# Altium project ExoSkeleton Master PCB V1.0.PrjPcb
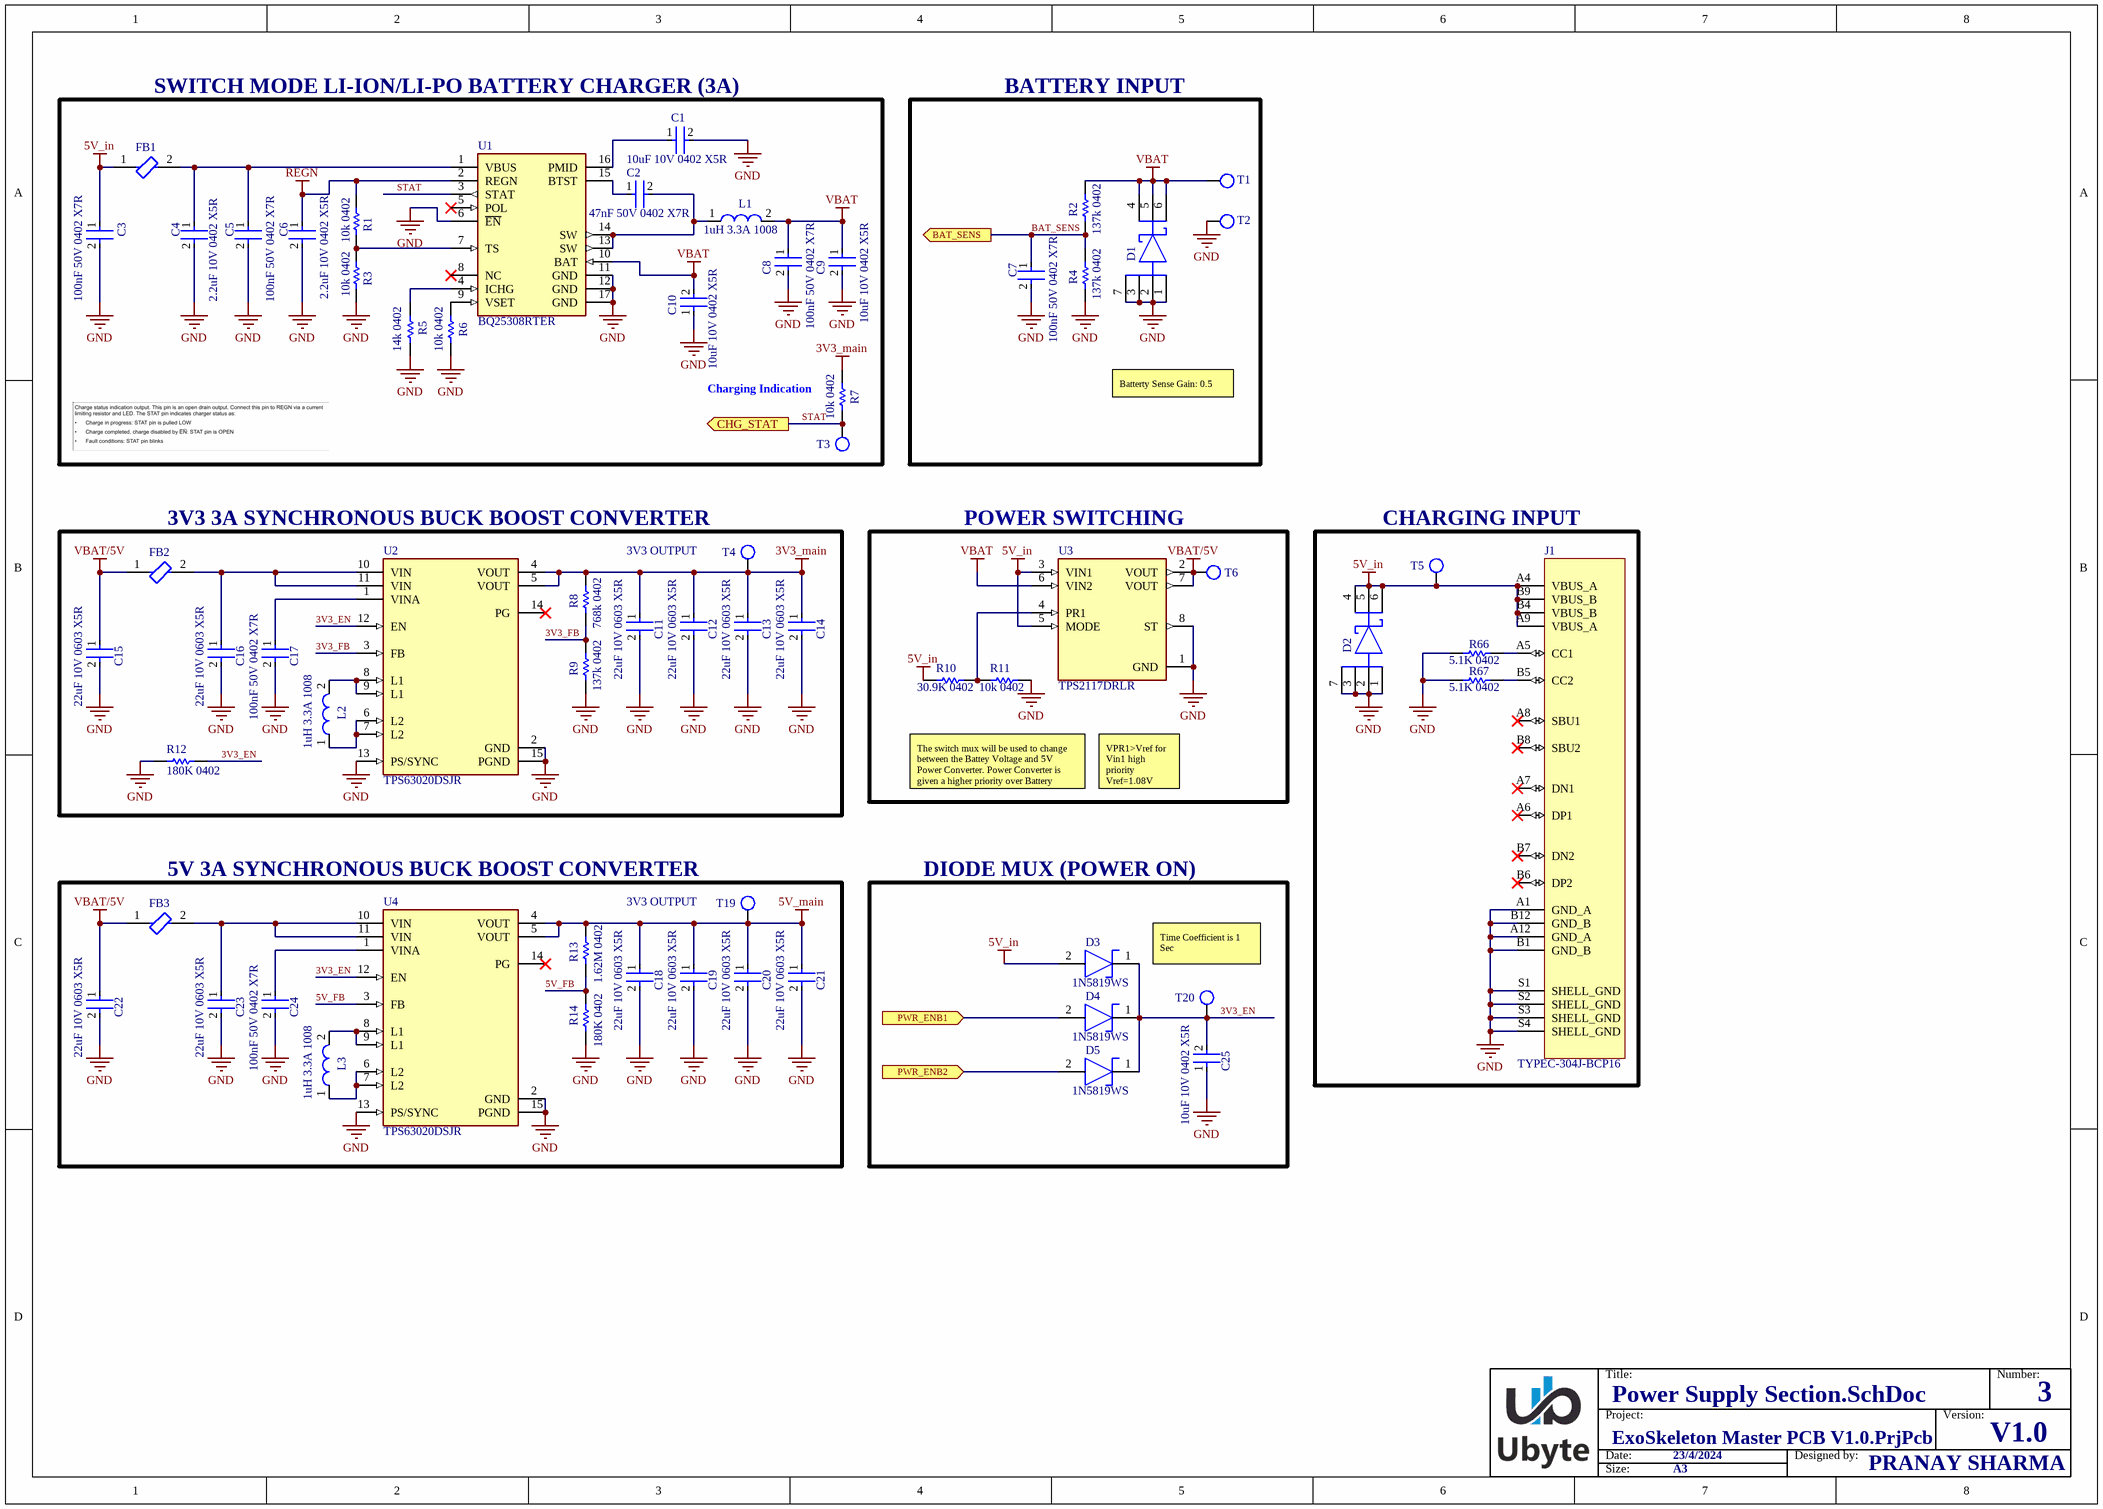
[diagram p0: Power Supply Section.SchDoc]
3 sheets, 130 parts. Net scope: flat (ports and power ports of the same name join across sheets).
Board file: PCB V1.0.PcbDoc
Sheets:
  Power Supply Section.SchDoc
  RS485 Com and Connectors.SchDoc
  IMU Section.SchDoc

## Sheet Power Supply Section.SchDoc
size A3; SheetNumber: 2; SheetTotal: 7

### Parts
C1  10uF 10V 0402 X5R  [0402 IPC CLASS C CAPACITOR]
C2  47nF 50V 0402 X7R  [0402 IPC CLASS C CAPACITOR]
C3  100nF 50V 0402 X7R  [0402 IPC CLASS C CAPACITOR]
C4  2.2uF 10V 0402 X5R  [0402 IPC CLASS C CAPACITOR]
C5  100nF 50V 0402 X7R  [0402 IPC CLASS C CAPACITOR]
C6  2.2uF 10V 0402 X5R  [0402 IPC CLASS C CAPACITOR]
C7  100nF 50V 0402 X7R  [0402 IPC CLASS C CAPACITOR]
C8  100nF 50V 0402 X7R  [0402 IPC CLASS C CAPACITOR]
C9  10uF 10V 0402 X5R  [0402 IPC CLASS C CAPACITOR]
C10  10uF 10V 0402 X5R  [0402 IPC CLASS C CAPACITOR]
C11  22uF 10V 0603 X5R  [0603 IPC CLASS C CAPACITOR]
C12  22uF 10V 0603 X5R  [0603 IPC CLASS C CAPACITOR]
C13  22uF 10V 0603 X5R  [0603 IPC CLASS C CAPACITOR]
C14  22uF 10V 0603 X5R  [0603 IPC CLASS C CAPACITOR]
C15  22uF 10V 0603 X5R  [0603 IPC CLASS C CAPACITOR]
C16  22uF 10V 0603 X5R  [0603 IPC CLASS C CAPACITOR]
C17  100nF 50V 0402 X7R  [0402 IPC CLASS C CAPACITOR]
C18  22uF 10V 0603 X5R  [0603 IPC CLASS C CAPACITOR]
C19  22uF 10V 0603 X5R  [0603 IPC CLASS C CAPACITOR]
C20  22uF 10V 0603 X5R  [0603 IPC CLASS C CAPACITOR]
C21  22uF 10V 0603 X5R  [0603 IPC CLASS C CAPACITOR]
C22  22uF 10V 0603 X5R  [0603 IPC CLASS C CAPACITOR]
C23  22uF 10V 0603 X5R  [0603 IPC CLASS C CAPACITOR]
C24  100nF 50V 0402 X7R  [0402 IPC CLASS C CAPACITOR]
C25  10uF 10V 0402 X5R  [0402 IPC CLASS C CAPACITOR]
D1  (no value)  [DRV0006A IPC-C]
D2  (no value)  [DRV0006A IPC-C]
D3  1N5819WS  [SOD-323 IPC-C]
D4  1N5819WS  [SOD-323 IPC-C]
D5  1N5819WS  [SOD-323 IPC-C]
FB1  BLM21SP111SN1D  [0603 IPC CLASS C FERRITE BEAD]  (value not drawn)
FB2  BLM21SP111SN1D  [0603 IPC CLASS C FERRITE BEAD]  (value not drawn)
FB3  BLM21SP111SN1D  [0603 IPC CLASS C FERRITE BEAD]  (value not drawn)
J1  TYPEC-304J-BCP16  [VALCON_CSP-USC16-TR]
L1  1uH 3.3A 1008  [1008 Inductor IPC-C]
L2  1uH 3.3A 1008  [1008 Inductor IPC-C]
L3  1uH 3.3A 1008  [1008 Inductor IPC-C]
R1  10k 0402  [0402 IPC CLASS C RESISTOR]
R2  137k 0402  [0402 IPC CLASS C RESISTOR]
R3  10k 0402  [0402 IPC CLASS C RESISTOR]
R4  137k 0402  [0402 IPC CLASS C RESISTOR]
R5  14k 0402  [0402 IPC CLASS C RESISTOR]
R6  10k 0402  [0402 IPC CLASS C RESISTOR]
R7  10k 0402  [0402 IPC CLASS C RESISTOR]
R8  768k 0402  [0402 IPC CLASS C RESISTOR]
R9  137k 0402  [0402 IPC CLASS C RESISTOR]
R10  30.9K 0402  [0402 IPC CLASS C RESISTOR]
R11  10k 0402  [0402 IPC CLASS C RESISTOR]
R12  180K 0402  [0402 IPC CLASS C RESISTOR]
R13  1.62M 0402  [0402 IPC CLASS C RESISTOR]
R14  180K 0402  [0402 IPC CLASS C RESISTOR]
R66  5.1K 0402  [0402 IPC CLASS C RESISTOR]
R67  5.1K 0402  [0402 IPC CLASS C RESISTOR]
T1  Test Point TH  [Test Point TH]  (value not drawn)  (no BOM)
T2  Test Point TH  [Test Point TH]  (value not drawn)  (no BOM)
T3  TP  [Testpoint1]  (value not drawn)  (no BOM)
T4  TP  [Testpoint1]  (value not drawn)  (no BOM)
T5  TP  [Testpoint1]  (value not drawn)  (no BOM)
T6  TP  [Testpoint1]  (value not drawn)  (no BOM)
T19  TP  [Testpoint1]  (value not drawn)  (no BOM)
T20  TP  [Testpoint1]  (value not drawn)  (no BOM)
U1  BQ25308RTER  [RTE0016C IPC-C]
U2  TPS63020DSJR  [FP-DSJ0014A-MFG]
U3  TPS2117DRLR  [DRL0008A IPC-C]
U4  TPS63020DSJR  [FP-DSJ0014A-MFG]

### Blocks framed on the sheet
SWITCH MODE LI-ION/LI-PO BATTERY CHARGER (3A): C1-C6 C8-C10 FB1 L1 R1 R3 R5-R7 T3 U1
BATTERY INPUT: C7 D1 R2 R4 T1 T2
3V3 3A SYNCHRONOUS BUCK BOOST CONVERTER: C11-C17 FB2 L2 R8 R9 R12 T4 U2
POWER SWITCHING: R10 R11 T6 U3
CHARGING INPUT: D2 J1 R66 R67 T5
5V 3A SYNCHRONOUS BUCK BOOST CONVERTER: C18-C24 FB3 L3 R13 R14 T19 U4
DIODE MUX (POWER ON): C25 D3-D5 T20

### Ports
BAT_SENS (out), CHG_STAT (out), PWR_ENB1 (in), PWR_ENB2 (in)

### Nets
3V3_main: C11.1 C12.1 C13.1 C14.1 R7.2 R8.1 T4.0 U2.4(VOUT) U2.5(VOUT)
5V_in: C3.1 D2.4 D2.5 D2.6 D3.2(A) FB1.1 J1.A4(VBUS_A) J1.A9(VBUS_A) J1.B4(VBUS_B) J1.B9(VBUS_B) R10.2 T5.0 U3.3(VIN1) U3.5(MODE)
5V_main: C18.1 C19.1 C20.1 C21.1 R13.2 T19.0 U4.4(VOUT) U4.5(VOUT)
GND: C1.2 C3.2 C4.2 C5.2 C6.2 C7.2 C8.2 C9.2 C10.1 C11.2 C12.2 C13.2 C14.2 C15.2 C16.2 C17.2 C18.2 C19.2 C20.2 C21.2 C22.2 C23.2 C24.2 C25.1 D1.1(C) D1.2(A) D1.3 D1.7 D2.1(C) D2.2(A) D2.3 D2.7 J1.A1(GND_A) J1.A12(GND_A) J1.B1(GND_B) J1.B12(GND_B) J1.S1(SHELL_GND) J1.S2(SHELL_GND) J1.S3(SHELL_GND) J1.S4(SHELL_GND) R3.1 R4.1 R5.1 R6.1 R9.1 R11.1 R12.2 R14.1 R66.1 R67.1 T2.0 U1.6(~{EN}) U1.11(GND) U1.12(GND) U1.17(GND) U2.2(GND) U2.13(PS/SYNC) U2.15(PGND) U3.1(GND) U3.8(ST) U4.2(GND) U4.13(PS/SYNC) U4.15(PGND)
REGN: C6.1 R1.2 U1.2(REGN)
VBAT: C8.1 C9.1 C10.2 D1.4 D1.5 D1.6 L1.2 R2.2 T1.0 U1.10(BAT) U3.6(VIN2)
VBAT/5V: C15.1 C22.1 FB2.1 FB3.1 T6.0 U3.2(VOUT) U3.7(VOUT)
3V3_EN: C25.2 D3.1(C) D4.1(C) D5.1(C) R12.1 T20.0 U2.12(EN) U4.12(EN)
3V3_FB: R8.2 R9.2 U2.3(FB)
5V_FB: R13.1 R14.2 U4.3(FB)
BAT_SENS: C7.1 R2.1 R4.2 ; port BAT_SENS
STAT: R7.1 T3.0 U1.3(STAT) ; port CHG_STAT
NetC1_1: C1.1 U1.16(PMID)
NetC2_1: C2.1 U1.15(BTST)
NetC2_2: C2.2 L1.1 U1.13(SW) U1.14(SW)
NetC4_1: C4.1 C5.1 FB1.2 U1.1(VBUS)
NetC16_1: C16.1 FB2.2 U2.10(VIN) U2.11(VIN)
NetC17_1: C17.1 U2.1(VINA)
NetC23_1: C23.1 FB3.2 U4.10(VIN) U4.11(VIN)
NetC24_1: C24.1 U4.1(VINA)
NetD4_2: D4.2(A) ; port PWR_ENB1
NetD5_2: D5.2(A) ; port PWR_ENB2
NetJ1_A5: J1.A5(CC1) R66.2
NetJ1_B5: J1.B5(CC2) R67.2
NetL2_1: L2.1 U2.6(L2) U2.7(L2)
NetL2_2: L2.2 U2.8(L1) U2.9(L1)
NetL3_1: L3.1 U4.6(L2) U4.7(L2)
NetL3_2: L3.2 U4.8(L1) U4.9(L1)
NetR1_1: R1.1 R3.2 U1.7(TS)
NetR5_2: R5.2 U1.4(ICHG)
NetR6_2: R6.2 U1.9(VSET)
NetR10_1: R10.1 R11.2 U3.4(PR1)

Not connected (* = marked no-connect by the designer): J1 A6(DP1)* A7(DN1)* A8(SBU1)* B6(DP2)* B7(DN2)* B8(SBU2)*; U1 5(POL)* 8(NC)*; U2 14(PG)*; U4 14(PG)*

### Notes on the sheet
- (near R7) Charging Indication
- Batterty Sense Gain: 0.5
- 3V3 OUTPUT
- The switch mux will be used to change between the Battey Voltage and 5V Power Converter. Power Converter is given a higher priority over Battery
- VPR1>Vref for Vin1 high priority
  Vref=1.08V
- Time Coefficient is 1 Sec
- Title:
- Number:
- Date:
- Project:
- 23/4/2024
- Designed by:
- Version:
- V1.0
- 3
- Size:
- A3
- PRANAY SHARMA

### Library data of the parts
D1 D2 = TVS0500DRVR
J1 = USB Type C
L1-L3 = DFE252012F-1R0M=P2
R1-R4 R6-R9 R11 = 10k 1% 0402
R5 = 14k 1% 0402
R10 = 30.9K 1%  0402
R12 R14 = 180K 1% 0402
R13 = 1.62M 1% 0402
R66 R67 = 5.1K 1% 0402
T3-T6 T19 T20 = Testpoint1
U2 U4 = CMP-2000-07282-2

## Sheet RS485 Com and Connectors.SchDoc
size A4; SheetNumber: 3; SheetTotal: 7
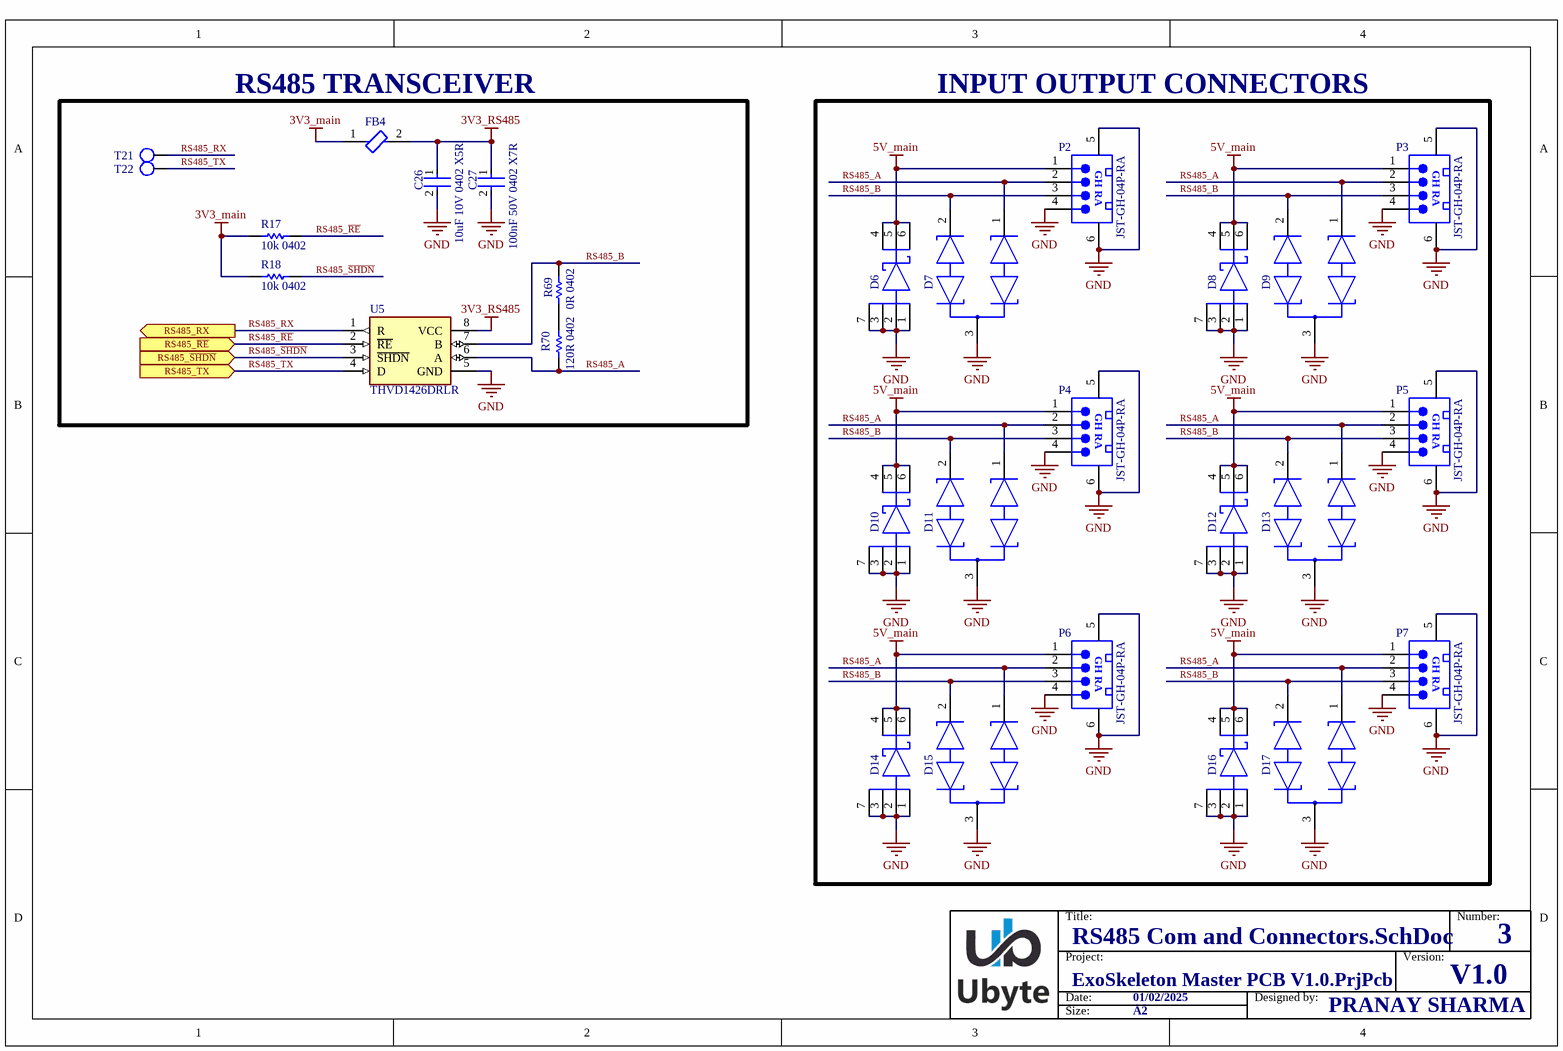
[diagram p1: RS485 Com and Connectors.SchDoc]

### Parts
C26  10uF 10V 0402 X5R  [0402 IPC CLASS C CAPACITOR]
C27  100nF 50V 0402 X7R  [0402 IPC CLASS C CAPACITOR]
D6  (no value)  [DRV0006A IPC-C]
D7  (no value)  [FP-SOT23-IPC_C]
D8  (no value)  [DRV0006A IPC-C]
D9  (no value)  [FP-SOT23-IPC_C]
D10  (no value)  [DRV0006A IPC-C]
D11  (no value)  [FP-SOT23-IPC_C]
D12  (no value)  [DRV0006A IPC-C]
D13  (no value)  [FP-SOT23-IPC_C]
D14  (no value)  [DRV0006A IPC-C]
D15  (no value)  [FP-SOT23-IPC_C]
D16  (no value)  [DRV0006A IPC-C]
D17  (no value)  [FP-SOT23-IPC_C]
FB4  BLM15AX102SN1D  [0402 IPC CLASS C FERRITE BEAD]  (value not drawn)
P2  JST-GH-04P-RA  [JST-GH-04P-RA]
P3  JST-GH-04P-RA  [JST-GH-04P-RA]
P4  JST-GH-04P-RA  [JST-GH-04P-RA]
P5  JST-GH-04P-RA  [JST-GH-04P-RA]
P6  JST-GH-04P-RA  [JST-GH-04P-RA]
P7  JST-GH-04P-RA  [JST-GH-04P-RA]
R17  10k 0402  [0402 IPC CLASS C RESISTOR]
R18  10k 0402  [0402 IPC CLASS C RESISTOR]
R69  0R 0402  [0402 IPC CLASS B RESISTOR]
R70  120R 0402  [0402 IPC CLASS C RESISTOR]
T21  TP  [Testpoint1]  (value not drawn)  (no BOM)
T22  TP  [Testpoint1]  (value not drawn)  (no BOM)
U5  THVD1426DRLR  [DRL0008A IPC-C]

### Blocks framed on the sheet
RS485 TRANSCEIVER: C26 C27 FB4 R17 R18 R69 R70 T21 T22 U5
INPUT OUTPUT CONNECTORS: D6-D17 P2-P7

### Ports
RS485_RX (out), RS485_TX (in), RS485_~{RE} (in), RS485_~{SHDN} (in)

### Nets
3V3_main: FB4.1 R17.2 R18.2
3V3_RS485: C26.1 C27.1 FB4.2 U5.8(VCC)
5V_main: D6.4 D6.5 D6.6 D8.4 D8.5 D8.6 D10.4 D10.5 D10.6 D12.4 D12.5 D12.6 D14.4 D14.5 D14.6 D16.4 D16.5 D16.6 P2.1 P3.1 P4.1 P5.1 P6.1 P7.1
GND: C26.2 C27.2 D6.1(C) D6.2(A) D6.3 D6.7 D7.3(CC) D8.1(C) D8.2(A) D8.3 D8.7 D9.3(CC) D10.1(C) D10.2(A) D10.3 D10.7 D11.3(CC) D12.1(C) D12.2(A) D12.3 D12.7 D13.3(CC) D14.1(C) D14.2(A) D14.3 D14.7 D15.3(CC) D16.1(C) D16.2(A) D16.3 D16.7 D17.3(CC) P2.4 P2.5 P2.6 P3.4 P3.5 P3.6 P4.4 P4.5 P4.6 P5.4 P5.5 P5.6 P6.4 P6.5 P6.6 P7.4 P7.5 P7.6 U5.5(GND)
RS485_A: D7.1(K1) D9.1(K1) D11.1(K1) D13.1(K1) D15.1(K1) D17.1(K1) P2.2 P3.2 P4.2 P5.2 P6.2 P7.2 R70.1 U5.6(A)
RS485_B: D7.2(K2) D9.2(K2) D11.2(K2) D13.2(K2) D15.2(K2) D17.2(K2) P2.3 P3.3 P4.3 P5.3 P6.3 P7.3 R69.2 U5.7(B)
RS485_~{RE}: R17.1 U5.2(~{RE}) ; port RS485_~{RE}
RS485_RX: T21.0 U5.1(R) ; port RS485_RX
RS485_~{SHDN}: R18.1 U5.3(~{SHDN}) ; port RS485_~{SHDN}
RS485_TX: T22.0 U5.4(D) ; port RS485_TX
NetR69_1: R69.1 R70.2

### Notes on the sheet
- Title:
- Number:
- Date:
- Project:
- 01/02/2025
- Designed by:
- Version:
- V1.0
- Size:
- A2
- PRANAY SHARMA
- (in symbol JST-GH-04P-RA) GH RA

### Library data of the parts
D6 D8 D10 D12 D14 D16 = TVS0500DRVR
D7 D9 D11 D13 D15 D17 = SM712
R17 R18 = 10k 1% 0402
R69 = 0R 1% 0402
R70 = 120R 1% 0402
T21 T22 = Testpoint1

## Sheet IMU Section.SchDoc
size A4; SheetNumber: 4; SheetTotal: 7
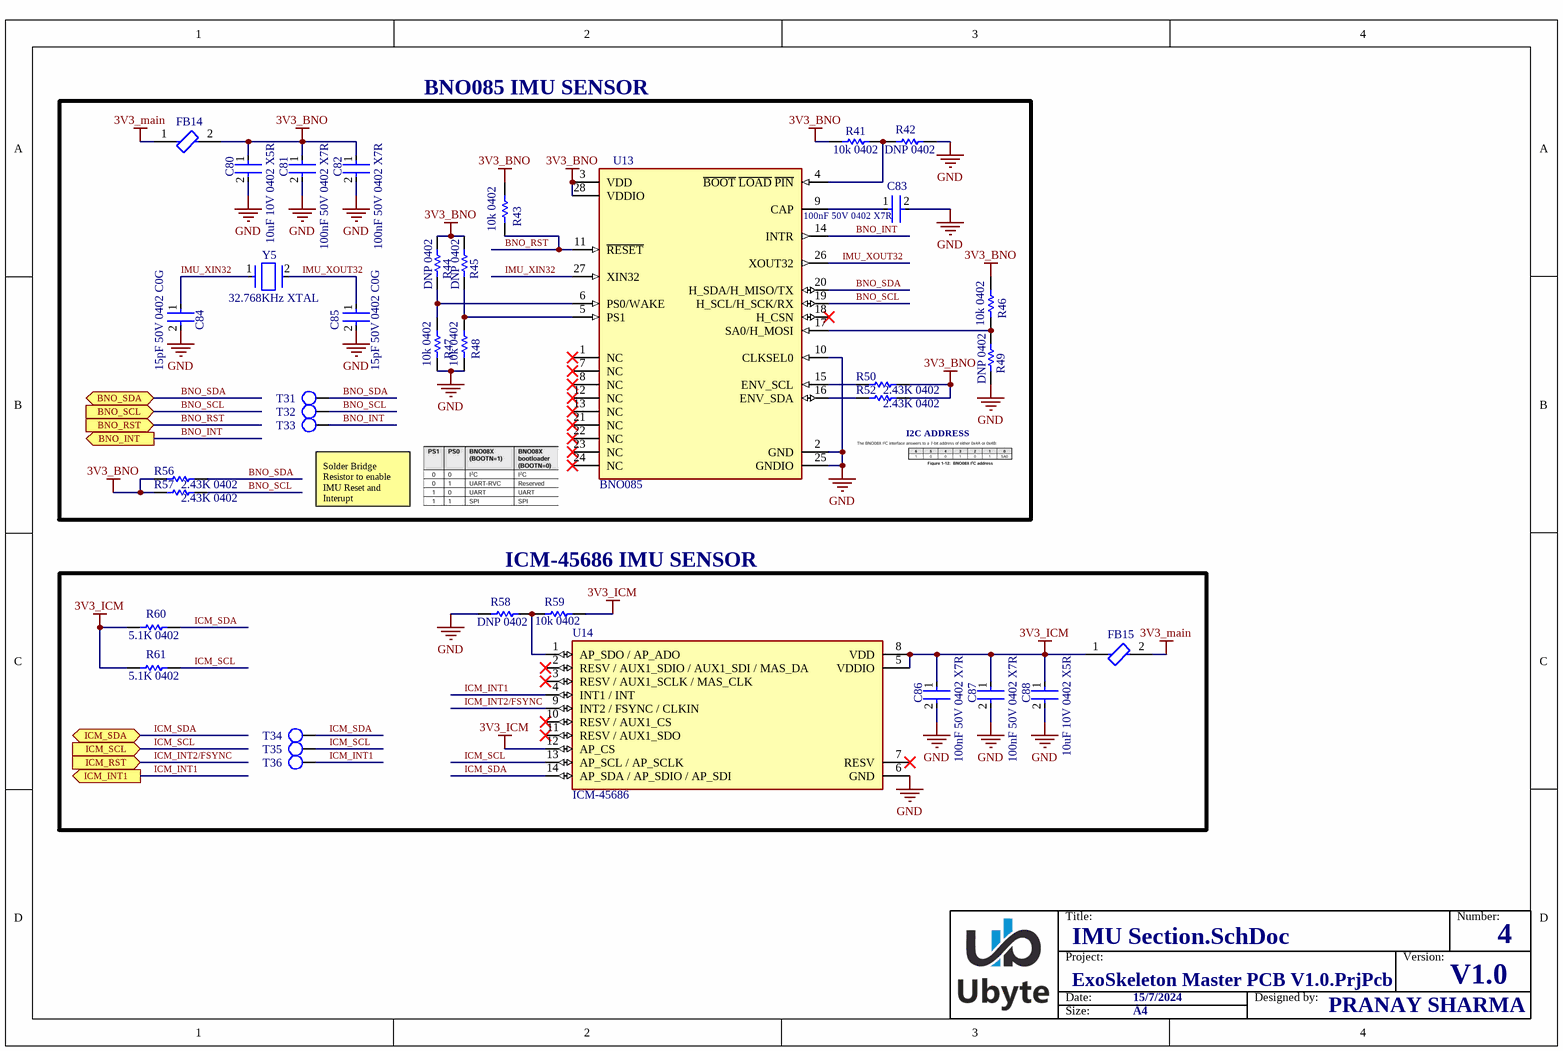
[diagram p2: IMU Section.SchDoc]

### Parts
C80  10uF 10V 0402 X5R  [0402 IPC CLASS C CAPACITOR]
C81  100nF 50V 0402 X7R  [0402 IPC CLASS C CAPACITOR]
C82  100nF 50V 0402 X7R  [0402 IPC CLASS C CAPACITOR]
C83  100nF 50V 0402 X7R  [0402 IPC CLASS C CAPACITOR]
C84  15pF 50V 0402 C0G  [0402 IPC CLASS C CAPACITOR]
C85  15pF 50V 0402 C0G  [0402 IPC CLASS C CAPACITOR]
C86  100nF 50V 0402 X7R  [0402 IPC CLASS C CAPACITOR]
C87  100nF 50V 0402 X7R  [0402 IPC CLASS C CAPACITOR]
C88  10uF 10V 0402 X5R  [0402 IPC CLASS C CAPACITOR]
FB14  BLM15AX102SN1D  [0402 IPC CLASS C FERRITE BEAD]  (value not drawn)
FB15  BLM15AX102SN1D  [0402 IPC CLASS C FERRITE BEAD]  (value not drawn)
R41  10k 0402  [0402 IPC CLASS C RESISTOR]
R42  DNP 0402  [0402 IPC CLASS C RESISTOR]
R43  10k 0402  [0402 IPC CLASS C RESISTOR]
R44  DNP 0402  [0402 IPC CLASS C RESISTOR]
R45  DNP 0402  [0402 IPC CLASS C RESISTOR]
R46  10k 0402  [0402 IPC CLASS C RESISTOR]
R47  10k 0402  [0402 IPC CLASS C RESISTOR]
R48  10k 0402  [0402 IPC CLASS C RESISTOR]
R49  DNP 0402  [0402 IPC CLASS C RESISTOR]
R50  2.43K 0402  [0402 IPC CLASS C RESISTOR]
R52  2.43K 0402  [0402 IPC CLASS C RESISTOR]
R56  2.43K 0402  [0402 IPC CLASS C RESISTOR]
R57  2.43K 0402  [0402 IPC CLASS C RESISTOR]
R58  DNP 0402  [0402 IPC CLASS C RESISTOR]
R59  10k 0402  [0402 IPC CLASS C RESISTOR]
R60  5.1K 0402  [0402 IPC CLASS C RESISTOR]
R61  5.1K 0402  [0402 IPC CLASS C RESISTOR]
T31  TP  [Testpoint1]  (value not drawn)  (no BOM)
T32  TP  [Testpoint1]  (value not drawn)  (no BOM)
T33  TP  [Testpoint1]  (value not drawn)  (no BOM)
T34  TP  [Testpoint1]  (value not drawn)  (no BOM)
T35  TP  [Testpoint1]  (value not drawn)  (no BOM)
T36  TP  [Testpoint1]  (value not drawn)  (no BOM)
U13  BNO085  [LGA-28 BNO055 IPC-C]
U14  ICM-45686  [LGA-14 ICM-45686 IPC-C]
Y5  32.768KHz XTAL  [SMD3215-2P IPC-C]

### Blocks framed on the sheet
BNO085 IMU SENSOR: C80-C85 FB14 R41-R50 R52 R56 R57 T31-T33 U13 Y5
ICM-45686 IMU SENSOR: C86-C88 FB15 R58-R61 T34-T36 U14

### Ports
BNO_INT (out), BNO_RST (in), BNO_SCL (in), BNO_SDA (bidir), ICM_INT1 (out), ICM_RST (in), ICM_SCL (in), ICM_SDA (bidir)

### Nets
3V3_BNO: C80.1 C81.1 C82.1 FB14.2 R41.1 R43.2 R44.2 R45.2 R46.2 R50.2 R52.2 R56.1 R57.1 U13.3(VDD) U13.28(VDDIO)
3V3_ICM: C86.1 C87.1 C88.1 FB15.1 R59.1 R60.1 R61.1 U14.5(VDDIO) U14.8(VDD) U14.12(AP_CS)
3V3_main: FB14.1 FB15.2
GND: C80.2 C81.2 C82.2 C83.2 C84.2 C85.2 C86.2 C87.2 C88.2 R42.1 R47.1 R48.1 R49.1 R58.2 U13.2(GND) U13.10(CLKSEL0) U13.25(GNDIO) U14.6(GND)
BNO_INT: T33.0 U13.14(INTR) ; port BNO_INT
BNO_RST: R43.1 U13.11(~{RESET}) ; port BNO_RST
BNO_SCL: R57.2 T32.0 U13.19(H_SCL/H_SCK/RX) ; port BNO_SCL
BNO_SDA: R56.2 T31.0 U13.20(H_SDA/H_MISO/TX) ; port BNO_SDA
ICM_INT1: T36.0 U14.4(INT1_/_INT) ; port ICM_INT1
ICM_INT2/FSYNC: U14.9(INT2_/_FSYNC_/_CLKIN) ; port ICM_RST
ICM_SCL: R61.2 T35.0 U14.13(AP_SCL_/_AP_SCLK) ; port ICM_SCL
ICM_SDA: R60.2 T34.0 U14.14(AP_SDA_/_AP_SDIO_/_AP_SDI) ; port ICM_SDA
IMU_XIN32: C84.1 U13.27(XIN32) Y5.1
IMU_XOUT32: C85.1 U13.26(XOUT32) Y5.2
NetC83_1: C83.1 U13.9(CAP)
NetR41_2: R41.2 R42.2 U13.4(~{BOOT}_~{LOAD}_~{PIN})
NetR44_1: R44.1 R47.2 U13.6(PS0/WAKE)
NetR45_1: R45.1 R48.2 U13.5(PS1)
NetR46_1: R46.1 R49.2 U13.17(SA0/H_MOSI)
NetR50_1: R50.1 U13.15(ENV_SCL)
NetR52_1: R52.1 U13.16(ENV_SDA)
NetR58_1: R58.1 R59.2 U14.1(AP_SDO_/_AP_ADO)

Not connected (* = marked no-connect by the designer): U13 1(NC)* 7(NC)* 8(NC)* 12(NC)* 13(NC)* 18(H_CSN)* 21(NC)* 22(NC)* 23(NC)* 24(NC)*; U14 2(RESV_/_AUX1_SDIO_/_AUX1_SDI_/_MAS_DA)* 3(RESV_/_AUX1_SCLK_/_MAS_CLK)* 7(RESV)* 10(RESV_/_AUX1_CS)* 11(RESV_/_AUX1_SDO)*

### Notes on the sheet
- I2C ADDRESS
- Solder Bridge Resistor to enable IMU Reset and Interupt
- Title:
- Number:
- Date:
- Project:
- 15/7/2024
- Designed by:
- Version:
- V1.0
- Size:
- A4
- PRANAY SHARMA

### Library data of the parts
R41 R43 R46-R48 R59 = 10k 1% 0402
R42 R44 R45 R49 R58 = 0R 1% 0402
R50 R52 R56 R57 = 2.43K 1% 0402
R60 R61 = 5.1K 1% 0402
T31-T36 = Testpoint1
Y5 = H31003271C2070CY

## Nets that join several sheets
3V3_main: Power Supply Section (9 pins), RS485 Com and Connectors (FB4.1 R17.2 R18.2), IMU Section (FB14.1 FB15.2)
5V_main: Power Supply Section (8 pins), RS485 Com and Connectors (24 pins)
GND: Power Supply Section (63 pins), RS485 Com and Connectors (51 pins), IMU Section (18 pins)